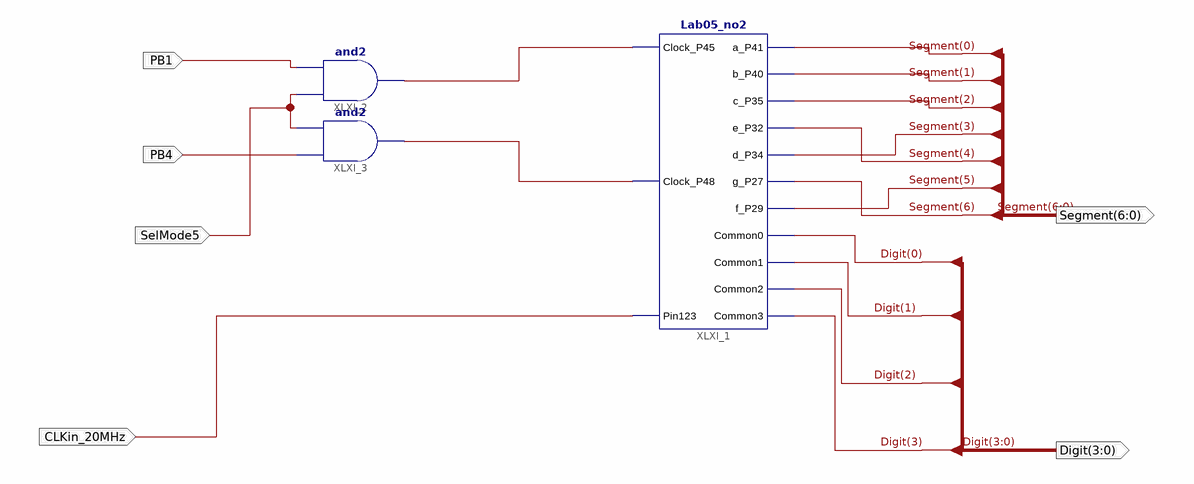
[diagram p0: schematic sheet 1]
// Xilinx ISE schematic moduleLab05.sch (spartan6) as structural Verilog: 3 symbols, 6 ports
module moduleLab05 (
  input  PB4,
  input  PB1,
  input  SelMode5,
  input  CLKin_20MHz,
  output [6:0] Segment,
  output [3:0] Digit
);

  wire XLXN_39, XLXN_40;

  Lab05_no2 XLXI_1 (
    .Clock_P45(XLXN_39), .Clock_P48(XLXN_40), .Pin123(CLKin_20MHz), .a_P41(Segment[0]), .b_P40(Segment[1]),
    .c_P35(Segment[2]), .e_P32(Segment[4]), .d_P34(Segment[3]), .g_P27(Segment[6]), .f_P29(Segment[5]),
    .Common0(Digit[0]), .Common1(Digit[1]), .Common2(Digit[2]), .Common3(Digit[3]));
  and XLXI_2 (XLXN_39, SelMode5, PB1);
  and XLXI_3 (XLXN_40, PB4, SelMode5);
endmodule
